# EasyEDA Pro project RadioFox.eprj, board PCB1
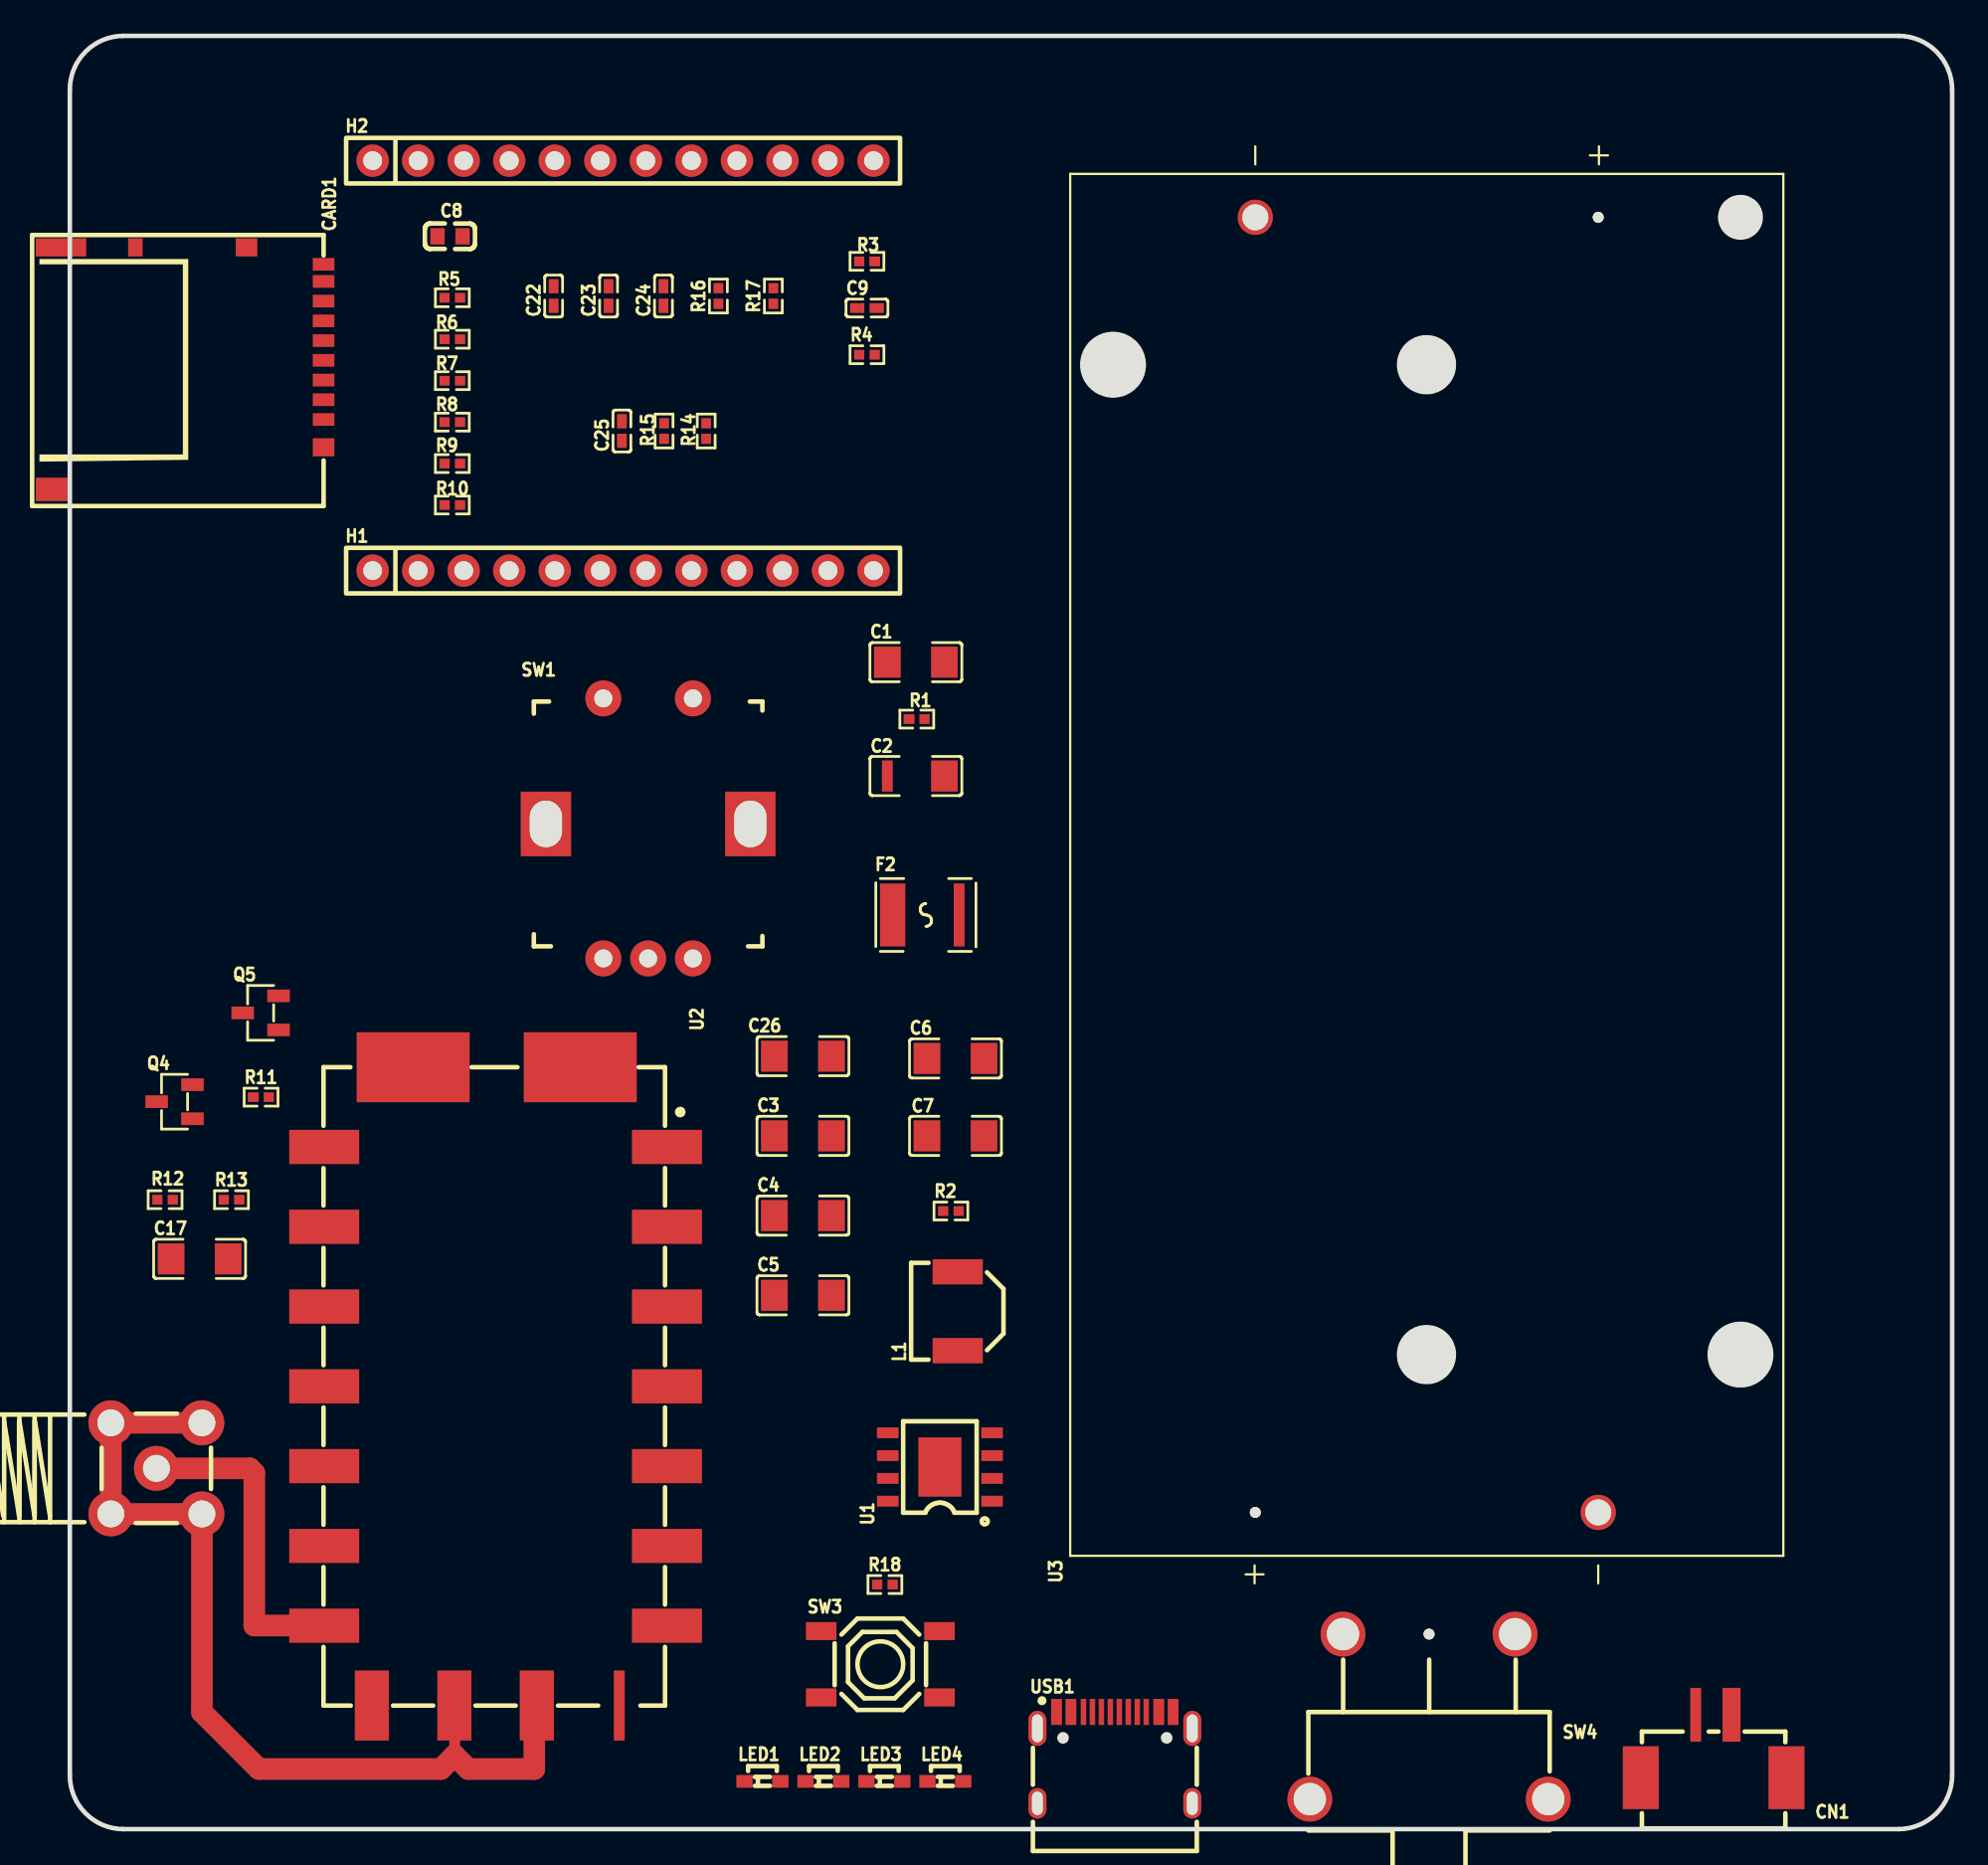
[diagram p8: board, top side]
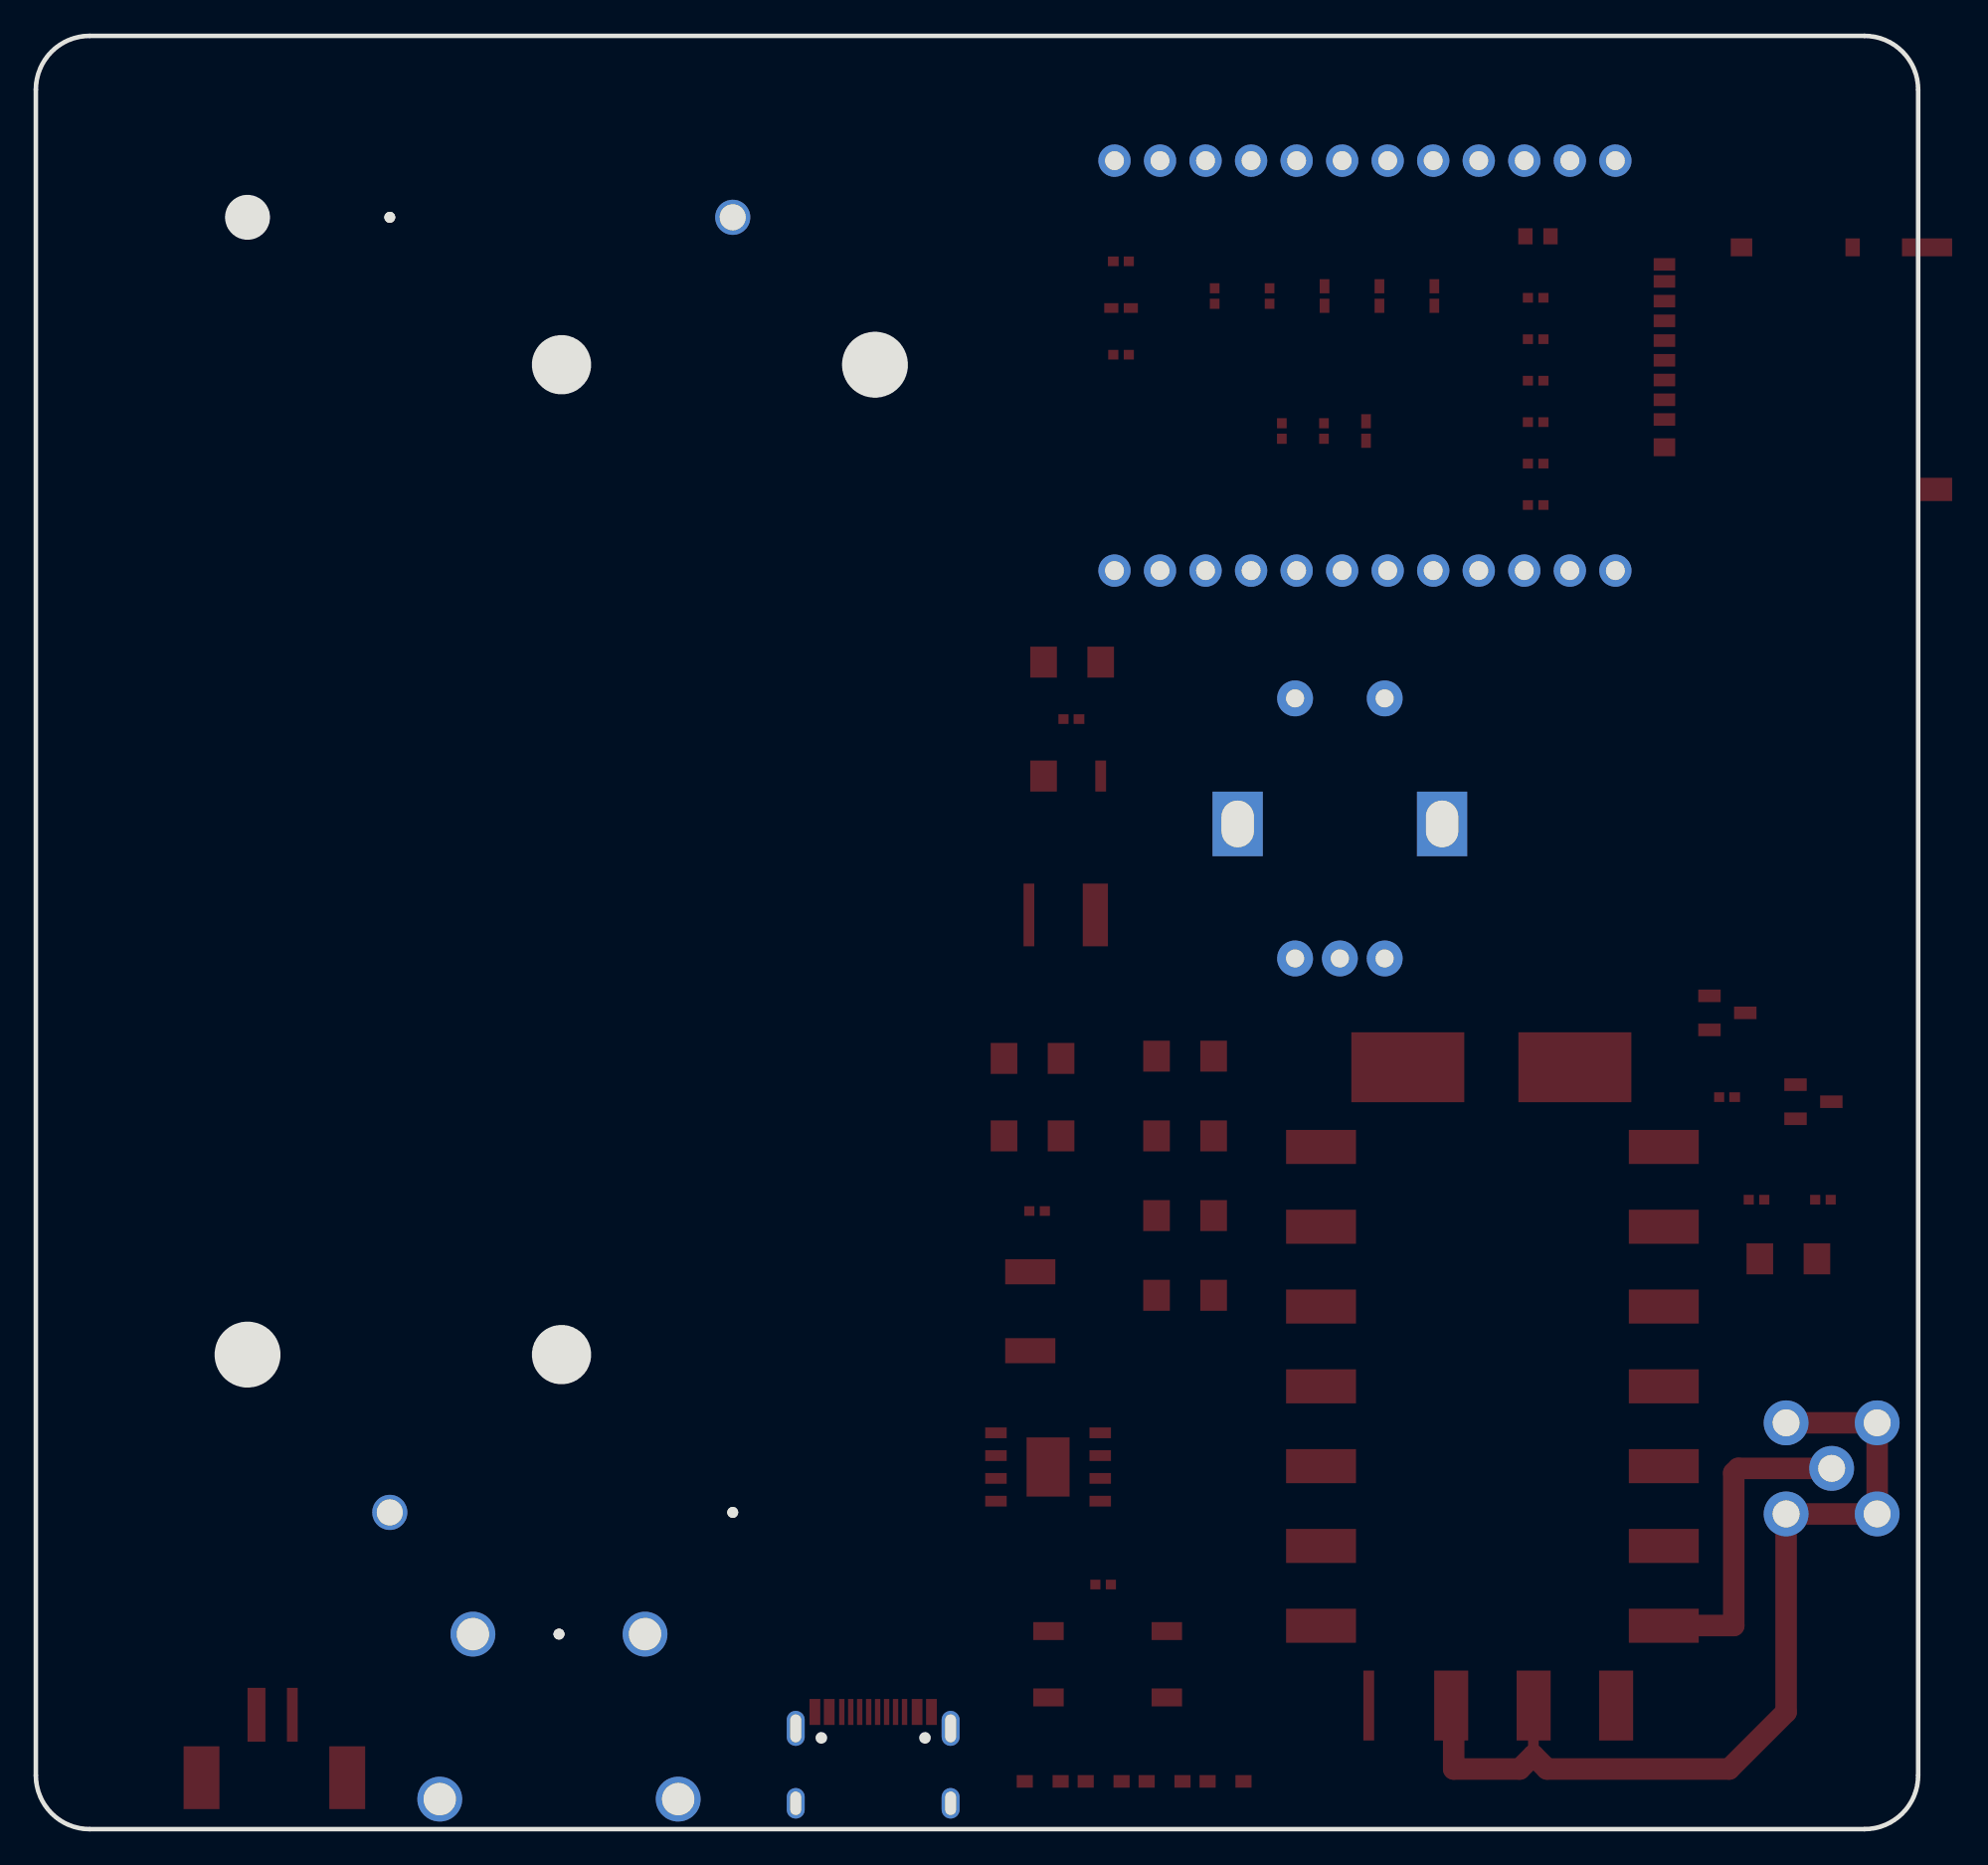
[diagram p9: board, bottom side, seen from below]

Outline 105 x 100 mm; copper layers: Top Layer, Bottom Layer. Coordinates in mm from the lower left corner of the outline.
Outline path: 0,97 0,3 arc(0.88,0.88) 3,0 102,0 arc(104.12,0.88) 105,3 105,97 arc(104.12,99.12) 102,100 3,100 arc(0.88,99.12) 0,97
Stack: Top Layer 0.035mm / Dielectric1 1.51mm FR4 er 4.5 / Bottom Layer 0.035mm

## Design rules (mm)
template: JLCPCB Capability(Two Layers Board)
spacing copperThickness1oz (default): track to track 0.102, other pairs 0.152 to 0.3
spacing copperThickness2oz: track to track 0.203, other pairs 0.152 to 0.3
track width copperThickness1oz (default): min 0.127, default 0.254, max 2.54
track width copperThickness2oz: min 0.203, default 0.254, max 2.54
differential pair differentialPair (default): width min 0.127, default 0.254, max 2.54; gap min 0.152, default 0.152
via viaSize (default): diameter min 0.5, default 0.61, max 10; hole min 0.3, default 0.305, max 6.3

## Placement (name value [footprint] x y rotation side)
C1  10uF  [C1206]  47.19 65.08 0 top
C2  10uF  [c1206]  47.19 58.73 180 top
C3  22uF  [C1206]  40.89 38.66 0 top
C4  22uF  [C1206]  40.89 34.21 0 top
C5  22uF  [C1206]  40.89 29.77 0 top
C6  10uF  [C1206]  49.4 42.98 0 top
C7  10uF  [C1206]  49.4 38.66 180 top
C8  100nF  [C0603]  21.21 88.82 0 top
C9  100nF  [C0402]  44.47 84.82 0 top
C17  10uF  [C1206]  7.24 31.8 0 top
C22  47nF  [C0402]  26.99 85.49 90 top
C23  47nF  [C0402]  30.05 85.49 90 top
C24  47nF  [C0402]  33.12 85.49 90 top
C25  10nF  [C0402]  30.8 77.97 90 top
C26  22uF  [C1206]  40.89 43.1 0 top
CARD1  DM3AT-SF-PEJM5  [SD-SMD_DM3AT-SF-PEJM5]  6.6 81.46 270 top
CN1  PH2.0-2P-LT  [conn-smd_ph2.0-1x2pw]  91.69 4.62 180 top
F2  BSMD1812-250-8V  [f1812]  47.75 50.98 0 top
H1  A2541HWV-12P  [HDR-TH_12P-P2.54-V-F]  30.86 70.18 0 top
H2  A2541HWV-12P  [HDR-TH_12P-P2.54-V-F]  30.86 93.04 0 top
L1  1uH  [IND-SMD_L5.4-W5.1_SPM5020]  49.53 28.88 90 top
LED1  MHS171WDT-C2  [LED-SMD_L2.0-W1.1-R-RD-SIDE_WHITE]  38.64 2.66 0 top
LED2  MHS171WDT-C2  [LED-SMD_L2.0-W1.1-R-RD-SIDE_WHITE]  42.04 2.66 0 top
LED3  MHS171WDT-C2  [LED-SMD_L2.0-W1.1-R-RD-SIDE_WHITE]  45.44 2.66 0 top
LED4  MHS171WDT-C2  [LED-SMD_L2.0-W1.1-R-RD-SIDE_WHITE]  48.84 2.66 0 top
Q4  2N7002_R1_00001  [SOT-23-3_L2.9-W1.3-P1.90-LS2.4-BR]  5.84 40.56 0 top
Q5  2N7002_R1_00001  [SOT-23-3_L2.9-W1.3-P1.90-LS2.4-BR]  10.64 45.52 0 top
R1  2Ω  [r0402]  47.24 61.9 180 top
R2  2Ω  [R0402]  49.15 34.47 0 top
R3  43kΩ  [r0402#2]  44.47 87.43 180 top
R4  100kΩ  [R0402]  44.47 82.22 0 top
R5  20kΩ  [R0402]  21.34 85.4 0 top
R6  20kΩ  [R0402]  21.34 83.08 0 top
R7  20kΩ  [R0402]  21.34 80.77 0 top
R8  20kΩ  [R0402]  21.34 78.46 0 top
R9  20kΩ  [R0402]  21.34 76.15 0 top
R10  20kΩ  [R0402]  21.34 73.84 0 top
R11  10K  [r0402#2]  10.67 40.82 0 top
R12  10kΩ  [R0402]  5.31 35.1 0 top
R13  47kΩ  [R0402]  9.02 35.1 0 top
R14  100kΩ  [R0402]  35.5 77.97 90 top
R15  100kΩ  [R0402]  33.15 77.97 90 top
R16  47kΩ  [R0402]  36.18 85.49 90 top
R17  47kΩ  [R0402]  39.24 85.49 90 top
R18  10kΩ  [R0402]  45.47 13.64 0 top
RF1  KH-SMA-P-8496  [SMA-TH_KH-SMA-P-8496]  4.83 20.12 90 top
SW1  PEC11R-4220F-S0012  [SW-TH_PEC11R-4220F-S0012]  32.26 55.8 0 top
SW3  TS-1187A-B-A-B  [SW-SMD_4P-L5.1-W5.1-P3.70-LS6.5-TL-2]  45.21 9.19 0 top
SW4  SS-12D11L5  [sw-th_ss-12d11l5]  75.82 6.27 180 top
U1  IP5306  [esop-8_l4.9-w3.9-p1.27-ls6.0-bl-ep]  48.53 20.19 90 top
U2  SA818S-V  [wirelm-smd_g-nicerf_sa818s-x]  23.75 24.69 270 top
U3  -  [bat_1049p]  75.69 53.77 90 top
USB1  YTC-TC16-473  [usb-smd_ytc-tc16-473]  58.29 3.99 0 top

## Footprints (pads in the part's own frame, mm; a bottom-side part is the same pattern mirrored in y, then rotated)
bat_1049p
  round 0.6 hole 1.45: 1(-36.11,9.565) 4(36.11,-9.565)
  round 1.958 hole 1.45: 2(36.11,9.565) 3(-36.11,-9.565)
C0402
  rect 0.79x0.54 smd: 1(-0.545,0) 2(0.545,0)
C0603
  rect 0.8x0.9 smd: 1(-0.7,0) 2(0.7,0)
c1206
  rect 1.485x1.728 smd: 1(-1.593,0)
  rect 0.6x1.728 smd: 2(1.593,0)
C1206
  rect 1.485x1.728 smd: 1(-1.593,0) 2(1.593,0)
conn-smd_ph2.0-1x2pw
  rect 1x3 smd: 1(-1,-1.756)
  rect 0.6x3 smd: 2(1,-1.756)
  rect 2x3.5 smd: 3(4.064,1.756) 4(-4.064,1.756)
esop-8_l4.9-w3.9-p1.27-ls6.0-bl-ep
  rect 0.6x1.2 smd: 1(-1.905,-2.909) 2(-0.635,-2.909) 3(0.635,-2.909) 4(1.905,-2.909) 5(1.905,2.909) 6(0.635,2.909) 7(-0.635,2.909) 8(-1.905,2.909)
  rect 3.3x2.4 smd: 9(0,0)
f1812
  rect 1.407x3.499 smd: 1(-1.853,0)
  rect 0.6x3.499 smd: 2(1.853,0)
HDR-TH_12P-P2.54-V-F
  round 1.8 hole 1.05: 1(-13.97,0) 2(-11.43,0) 3(-8.89,0) 4(-6.35,0) 5(-3.81,0) 6(-1.27,0) 7(1.27,0) 8(3.81,0) 9(6.35,0) 10(8.89,0) 11(11.43,0) 12(13.97,0)
IND-SMD_L5.4-W5.1_SPM5020
  rect 1.4x2.8 smd: 1(-2.2,0) 2(2.2,0)
LED-SMD_L2.0-W1.1-R-RD-SIDE_WHITE
  rect 0.9x0.7 smd: 1(1,0) 2(-1,0)
r0402
  rect 0.566x0.54 smd: 1(-0.433,0)
  rect 0.6x0.54 smd: 2(0.433,0)
r0402#2
  rect 0.6x0.54 smd: 1(-0.433,0)
  rect 0.566x0.54 smd: 2(0.433,0)
R0402
  rect 0.566x0.54 smd: 1(-0.433,0) 2(0.433,0)
SD-SMD_DM3AT-SF-PEJM5
  rect 0.7x1.2 smd: 1(2.85,7.55) 2(1.75,7.55) 3(0.65,7.55) 4(-0.45,7.55) 5(-1.55,7.55) 6(-2.65,7.55) 7(-3.75,7.55) 8(-4.85,7.55) 9(-5.8,7.55)
  rect 1x1.2 smd: 10(-6.75,3.25) 14(4.4,7.55)
  rect 1x0.8 smd: 11(-6.75,-2.95)
  rect 1x2.8 smd: 12(-6.75,-7.1)
  rect 1.3x1.9 smd: 13(6.75,-7.55)
SMA-TH_KH-SMA-P-8496
  round 2.5 hole 1.5: 1(-2.54,2.54) 2(2.54,2.54) 3(2.54,-2.54) 4(-2.54,-2.54) 5(0,0)
SOT-23-3_L2.9-W1.3-P1.90-LS2.4-BR
  rect 1.25x0.7 smd: 1(1,-0.95) 2(1,0.95) 3(-1,0)
SW-SMD_4P-L5.1-W5.1-P3.70-LS6.5-TL-2
  rect 1.7x1 smd: 1(-3.3,1.85) 2(3.3,1.85) 3(-3.3,-1.85) 4(3.3,-1.85)
SW-TH_PEC11R-4220F-S0012
  round 2 hole 1.005x1: 1(-2.499,7.25) 2(2.499,7.25) A(-2.499,-7.25) B(2.499,-7.25) C(0,-7.25)
  rect 2.8x3.6 hole 1.8x2.6: 3(-5.7,0.25) 3(5.7,0.25)
sw-th_ss-12d11l5
  round 2.5 hole 1.8: 1(-4.8,-4.6) 3(4.8,-4.6) 4(-6.65,4.6) 5(6.65,4.6)
  round 0.6 hole 1.8: 2(0,-4.6)
usb-smd_ytc-tc16-473
  oval 1x1.95 hole 0.6x1.55: 1(-4.32,1.633) 2(4.32,1.633)
  oval 1x1.7 hole 0.6x1.3: 3(-4.32,-2.547) 4(4.32,-2.547)
  rect 0.6x1.45 smd: A1B12(-3.25,2.547) A4B9(-2.45,2.547) B1A12(3.25,2.547) B4A9(2.45,2.547)
  rect 0.3x1.45 smd: A5(-1.25,2.547) A6(-0.25,2.547) A7(0.25,2.547) A8(1.25,2.547) B5(1.75,2.547) B6(0.75,2.547) B7(-0.75,2.547) B8(-1.75,2.547)
wirelm-smd_g-nicerf_sa818s-x
  rect 1.9x3.9 smd: 1(-13.352,9.56) 2(-8.902,9.56) 3(-4.452,9.56) 4(-0.003,9.56) 5(4.447,9.56) 6(8.898,9.56) 7(13.348,9.56) 12(13.348,-9.56) 13(8.898,-9.56) 14(4.447,-9.56) 15(-0.003,-9.56) 16(-4.452,-9.56) 17(-8.902,-9.56) 18(-13.352,-9.56)
  rect 3.9x0.6 smd: 8(17.797,6.9)
  rect 3.9x1.9 smd: 9(17.797,2.3) 10(17.797,-2.3) 11(17.797,-6.9)
  rect 3.9x6.3 smd: 19(-17.797,-4.6) 20(-17.797,4.72)

## Nets
3V3: C8.1 CARD1.4 H1.12 H2.1 R5.1 R6.1 R7.1 R8.1 R9.1 R10.1 R14.1 R16.1 R17.1
5V: H1.1 R11.1 SW4.2 U2.8
+5VREG: C3.1 C4.1 C5.1 C26.1 SW4.1 U1.8
GND: C1.1 C2.1 C3.2 C4.2 C5.2 C6.1 C8.2 C9.1 C22.2 C23.2 C24.2 C25.2 C26.2 CARD1.6 CARD1.10 CARD1.12 CARD1.13 CARD1.14 CN1.1 CN1.3 CN1.4 H1.2 H2.2 H2.3 H2.11 H2.12 Q4.2 Q5.2 R2.2 R4.2 R12.2 R15.1 RF1.1 RF1.2 RF1.3 RF1.4 SW1.2 SW1.3 SW1.C SW3.3 SW3.4 SW4.4 SW4.5 U1.9 U2.9 U2.10 U2.19 U2.20 U3.2 U3.3 USB1.1 USB1.2 USB1.3 USB1.4 USB1.A1B12 USB1.B1A12
VBAT+: F2.2 R3.1 U3.1 U3.4
AF_OUT: C25.1 H1.11 R14.2 R15.2 U2.3
ANT: RF1.5 U2.12
BATLEVELSENSE: C9.2 H2.5 R3.2 R4.1
H/L: Q4.3 U2.7
H/L_SIG: H2.4 Q4.1
LED1: LED1.1 LED2.2 U1.2
LED2: LED3.1 LED4.2 U1.3
LED3: LED1.2 LED2.1 LED3.2 LED4.1 U1.4
MIC-INPUT: C17.1 H1.7
POWER: C2.2 CN1.2 R1.2 U1.1 USB1.A4B9 USB1.B4A9
PTT: H2.8 U2.5
RADIO_SLEEP: Q5.3 R11.2 U2.6
RX_RF: H2.9 U2.16
SLEEP_CONTROL: H2.6 Q5.1
SW1: C22.1 H2.7 SW1.1
SWA: C23.1 H1.9 R17.2 SW1.A
SWB: C24.1 H1.10 R16.2 SW1.B
TX_RF: H2.10 U2.17
$1N118: CARD1.7 H1.3 R6.2
$1N119: CARD1.3 H1.4 R8.2
$1N120: CARD1.5 H1.5 R7.2
$1N121: CARD1.8 R5.2
$1N122: CARD1.2 H1.6 R9.2
$1N123: CARD1.1 R10.2
$1N921: C1.2 R1.1
$1N930: R12.1 R13.1 U2.18
$1N934: C17.2 R13.2
$1N9497: C7.1 R2.1
$1N10454: L1.1 U1.7
$1N10458: C6.2 C7.2 F2.1 L1.2 U1.6
$1N33469: R18.1 SW3.2
$1N33473: R18.2 U1.5

Pads without a net: CARD1 9 11; H1 8; SW3 1; SW4 3; U2 1 2 4 11 13 14 15; USB1 A5 A6 A7 A8 B5 B6 B7 B8

## Routing (per net, layer and track width the routed paths; a pad name or vN(x,y) marks a point on that pad's centre or on a via; arc(x,y) is an arc through that point)
GND: length 53.2
  Top Layer w0.6: 21.46,4.12 21.46,6.88 U2.10
  Top Layer w1.2: U2.9 25.91,6.75 25.91,3.35 22.23,3.35 21.46,4.12 20.7,3.35 10.54,3.35 7.37,6.53 7.37,17.58 2.29,17.58 RF1.2 RF1.3
ANT: length 18
  Top Layer w1.2: U2.12 14.18,11.35 10.29,11.35 10.29,19.86 10.03,20.12 RF1.5
